# Altium schematic sheet 四进四出三电机.SchDoc: 阿波罗混胶机控制器
size A4; Revision: V1.2; SheetNumber: 0; SheetTotal: 0
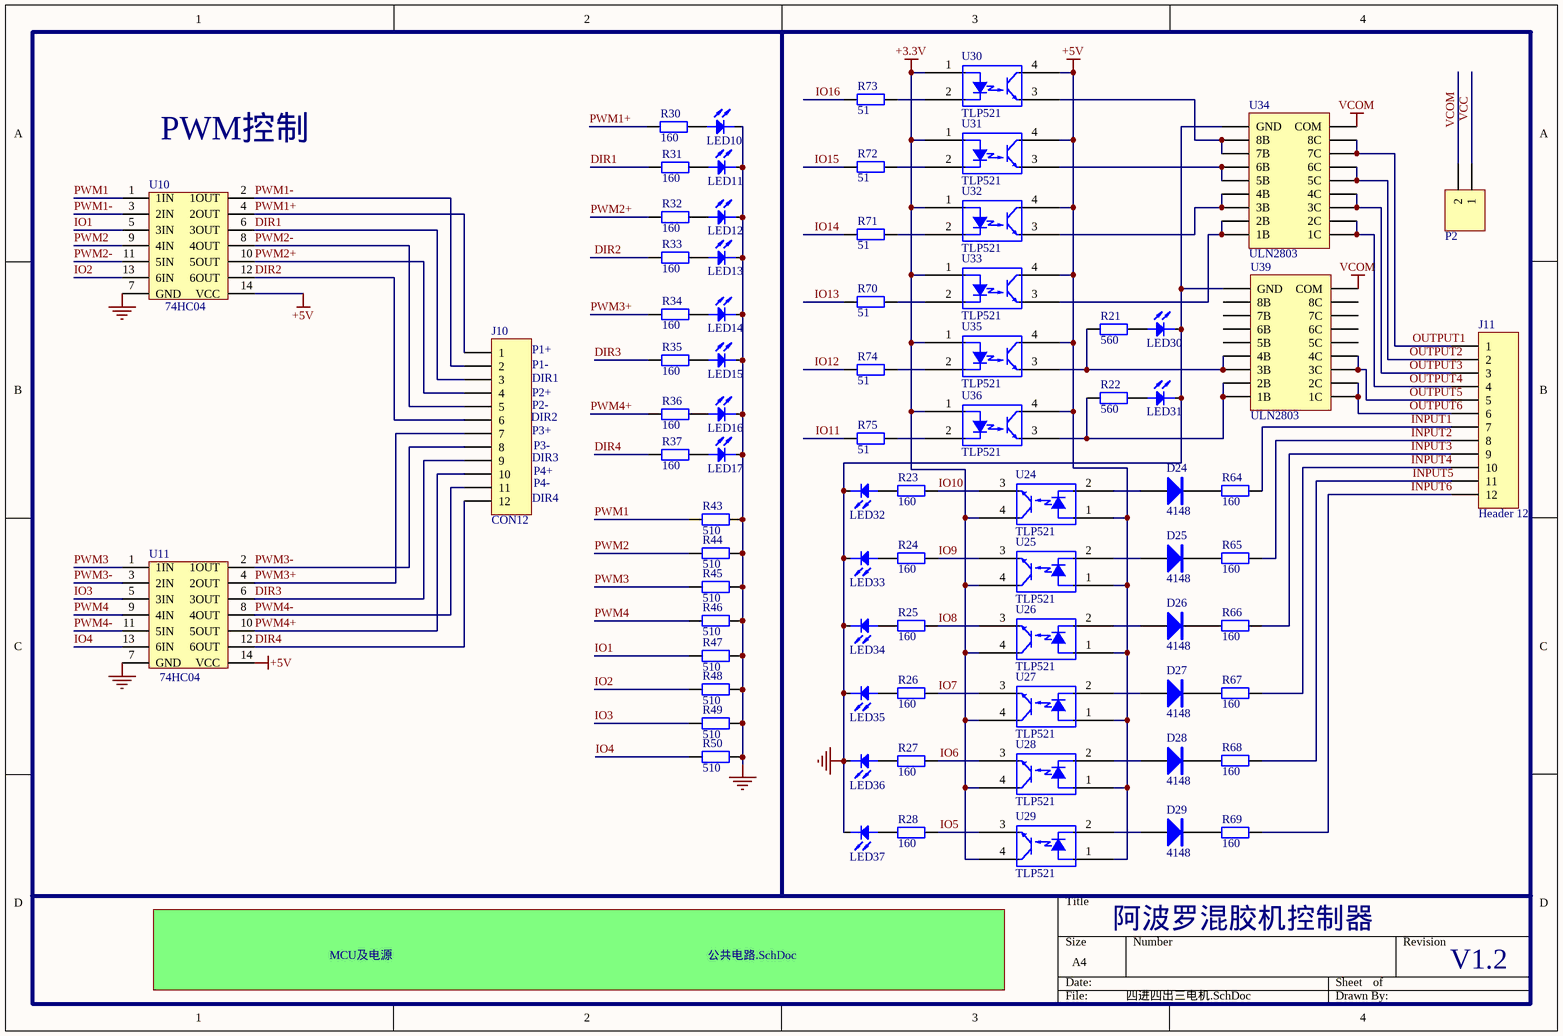
[diagram p0: 四进四出三电机.SchDoc]

## Parts
D24  4148  [贴片二极管]
D25  4148  [贴片二极管]
D26  4148  [贴片二极管]
D27  4148  [贴片二极管]
D28  4148  [贴片二极管]
D29  4148  [贴片二极管]
J10  CON12  [CON12-5.1卧]
J11  Header 12  [CON12-5.1卧]
LED10  LED  [LED2.5]  (value not drawn)
LED11  LED  [LED2.5]  (value not drawn)
LED12  LED  [LED2.5]  (value not drawn)
LED13  LED  [LED2.5]  (value not drawn)
LED14  LED  [LED2.5]  (value not drawn)
LED15  LED  [LED2.5]  (value not drawn)
LED16  LED  [LED2.5]  (value not drawn)
LED17  LED  [LED2.5]  (value not drawn)
LED30  LED  [LED2.5]  (value not drawn)
LED31  LED  [LED2.5]  (value not drawn)
LED32  LED  [LED2.5]  (value not drawn)
LED33  LED  [LED2.5]  (value not drawn)
LED34  LED  [LED2.5]  (value not drawn)
LED35  LED  [LED2.5]  (value not drawn)
LED36  LED  [LED2.5]  (value not drawn)
LED37  LED  [LED2.5]  (value not drawn)
P2  (no value)  [HDR1X2]
R21  560  [0603A]
R22  560  [0603A]
R23  160  [0603A]
R24  160  [0603A]
R25  160  [0603A]
R26  160  [0603A]
R27  160  [0603A]
R28  160  [0603A]
R30  160  [0603A]
R31  160  [0603A]
R32  160  [0603A]
R33  160  [0603A]
R34  160  [0603A]
R35  160  [0603A]
R36  160  [0603A]
R37  160  [0603A]
R43  510  [0603A]
R44  510  [0603A]
R45  510  [0603A]
R46  510  [0603A]
R47  510  [0603A]
R48  510  [0603A]
R49  510  [0603A]
R50  510  [0603A]
R64  160  [0603A]
R65  160  [0603A]
R66  160  [0603A]
R67  160  [0603A]
R68  160  [0603A]
R69  160  [0603A]
R70  51  [0603A]
R71  51  [0603A]
R72  51  [0603A]
R73  51  [0603A]
R74  51  [0603A]
R75  51  [0603A]
U10  74HC04  [so-14]
U11  74HC04  [so-14]
U24  TLP521  [PC817]
U25  TLP521  [PC817]
U26  TLP521  [PC817]
U27  TLP521  [PC817]
U28  TLP521  [PC817]
U29  TLP521  [PC817]
U30  TLP521  [PC817]
U31  TLP521  [PC817]
U32  TLP521  [PC817]
U33  TLP521  [PC817]
U34  ULN2803  [sol18]
U35  TLP521  [PC817]
U36  TLP521  [PC817]
U39  ULN2803  [sol18]

## Sub-sheets
MCU及电源 = 公共电路.SchDoc: no entries

## Nets
+3.3V: U24.4(COL) U25.4(COL) U26.4(COL) U27.4(COL) U28.4(COL) U29.4(COL) U30.1(ANODE) U31.1(ANODE) U32.1(ANODE) U33.1(ANODE) U35.1(ANODE) U36.1(ANODE)
+5V: U10.14(VCC) U11.14(VCC) U24.1(ANODE) U25.1(ANODE) U26.1(ANODE) U27.1(ANODE) U28.1(ANODE) U29.1(ANODE) U30.4(COL) U31.4(COL) U32.4(COL) U33.4(COL) U35.4(COL) U36.4(COL)
GND: LED10.K LED11.K LED12.K LED13.K LED14.K LED15.K LED16.K LED17.K LED30.K LED31.K LED32.K LED33.K LED34.K LED35.K LED36.K LED37.K R43.2 R44.2 R45.2 R46.2 R47.2 R48.2 R49.2 R50.2 U10.7(GND) U11.7(GND) U34.9(GND) U39.9(GND)
VCOM: P2.2 U34.10(COM) U39.10(COM)
DIR1: J10.3 R31.1 U10.6(3OUT)
DIR2: J10.6 R33.1 U10.12(6OUT)
DIR3: J10.9 R35.1 U11.6(3OUT)
DIR4: J10.12 R37.1 U11.12(6OUT)
INPUT1: J11.7 R64.2
INPUT2: J11.8 R65.2
INPUT3: J11.9 R66.2
INPUT4: J11.10 R67.2
INPUT5: J11.11 R68.2
INPUT6: J11.12 R69.2
IO1: R47.1 U10.5(3IN)
IO2: R48.1 U10.13(6IN)
IO3: R49.1 U11.5(3IN)
IO4: R50.1 U11.13(6IN)
IO5: R28.1 U29.3(EMIT)
IO6: R27.1 U28.3(EMIT)
IO7: R26.1 U27.3(EMIT)
IO8: R25.1 U26.3(EMIT)
IO9: R24.1 U25.3(EMIT)
IO10: R23.1 U24.3(EMIT)
IO11: R75.1
IO12: R74.1
IO13: R70.1
IO14: R71.1
IO15: R72.1
IO16: R73.1
OUTPUT1: J11.1 U34.11(8C) U34.12(7C)
OUTPUT2: J11.2 U34.13(6C) U34.14(5C)
OUTPUT3: J11.3 U34.15(4C) U34.16(3C)
OUTPUT4: J11.4 U34.17(2C) U34.18(1C)
OUTPUT5: J11.5 U39.15(4C) U39.16(3C)
OUTPUT6: J11.6 U39.17(2C) U39.18(1C)
PWM1: R43.1 U10.1(1IN)
PWM1+: J10.1 R30.1 U10.4(2OUT)
PWM1-: J10.2 U10.2(1OUT) U10.3(2IN)
PWM2: R44.1 U10.9(4IN)
PWM2+: J10.4 R32.1 U10.10(5OUT)
PWM2-: J10.5 U10.8(4OUT) U10.11(5IN)
PWM3: R45.1 U11.1(1IN)
PWM3+: J10.7 R34.1 U11.4(2OUT)
PWM3-: J10.8 U11.2(1OUT) U11.3(2IN)
PWM4: R46.1 U11.9(4IN)
PWM4+: J10.10 R36.1 U11.10(5OUT)
PWM4-: J10.11 U11.8(4OUT) U11.11(5IN)
VCC: P2.1
NetD24_A: D24.A U24.2(CATH)
NetD24_K: D24.K R64.1
NetD25_A: D25.A U25.2(CATH)
NetD25_K: D25.K R65.1
NetD26_A: D26.A U26.2(CATH)
NetD26_K: D26.K R66.1
NetD27_A: D27.A U27.2(CATH)
NetD27_K: D27.K R67.1
NetD28_A: D28.A U28.2(CATH)
NetD28_K: D28.K R68.1
NetD29_A: D29.A U29.2(CATH)
NetD29_K: D29.K R69.1
NetLED10_A: LED10.A R30.2
NetLED11_A: LED11.A R31.2
NetLED12_A: LED12.A R32.2
NetLED13_A: LED13.A R33.2
NetLED14_A: LED14.A R34.2
NetLED15_A: LED15.A R35.2
NetLED16_A: LED16.A R36.2
NetLED17_A: LED17.A R37.2
NetLED30_A: LED30.A R21.2
NetLED31_A: LED31.A R22.2
NetLED32_A: LED32.A R23.2
NetLED33_A: LED33.A R24.2
NetLED34_A: LED34.A R25.2
NetLED35_A: LED35.A R26.2
NetLED36_A: LED36.A R27.2
NetLED37_A: LED37.A R28.2
NetR21_1: R21.1 U35.3(EMIT) U39.3(3B) U39.4(4B)
NetR22_1: R22.1 U36.3(EMIT) U39.1(1B) U39.2(2B)
NetR70_2: R70.2 U33.2(CATH)
NetR71_2: R71.2 U32.2(CATH)
NetR72_2: R72.2 U31.2(CATH)
NetR73_2: R73.2 U30.2(CATH)
NetR74_2: R74.2 U35.2(CATH)
NetR75_2: R75.2 U36.2(CATH)
NetU30_3: U30.3(EMIT) U34.7(7B) U34.8(8B)
NetU31_3: U31.3(EMIT) U34.5(5B) U34.6(6B)
NetU32_3: U32.3(EMIT) U34.3(3B) U34.4(4B)
NetU33_3: U33.3(EMIT) U34.1(1B) U34.2(2B)

Not connected (* = marked no-connect by the designer): U39 5(5B) 6(6B) 7(7B) 8(8B) 11(8C) 12(7C) 13(6C) 14(5C)

## Notes on the sheet
- (near U10) PWM控制
- (near J10) P1+
- (near J10) P1-
- (near J10) DIR1
- (near J10) DIR2
- (near J10) P2-
- (near J10) P2+
- (near J10) P3+
- (near J10) P3-
- (near J10) DIR3
- (near J10) DIR4
- (near J10) P4+
- (near J10) P4-

## Library data of the parts
D24-D29 = 二极管
J10 J11 = Header 12: Header, 12-Pin; LatestRevisionDate: 17-Jul-2002; LatestRevisionNote: Re-released for DXP Platform.; Publisher: Altium Limited
P2 = Header 2: Header, 2-Pin; LatestRevisionDate: 17-Jul-2002; LatestRevisionNote: Re-released for DXP Platform.; Publisher: Altium Limited
R21-R28 R30-R37 R43-R50 R64-R75 = Res2: Resistor; Value: 1K; Published: 8-Jun-2000; LatestRevisionDate: 17-Jul-2002; LatestRevisionNote: Re-released for DXP Platform.; PackageReference: AXIAL-0.4; Publisher: Altium Limited
U24-U33 U35 U36 = TLP521-1: Single NPN PhotoTransistor OptoCoupler.